# Altium schematic sheet L506.SchDoc
size A3
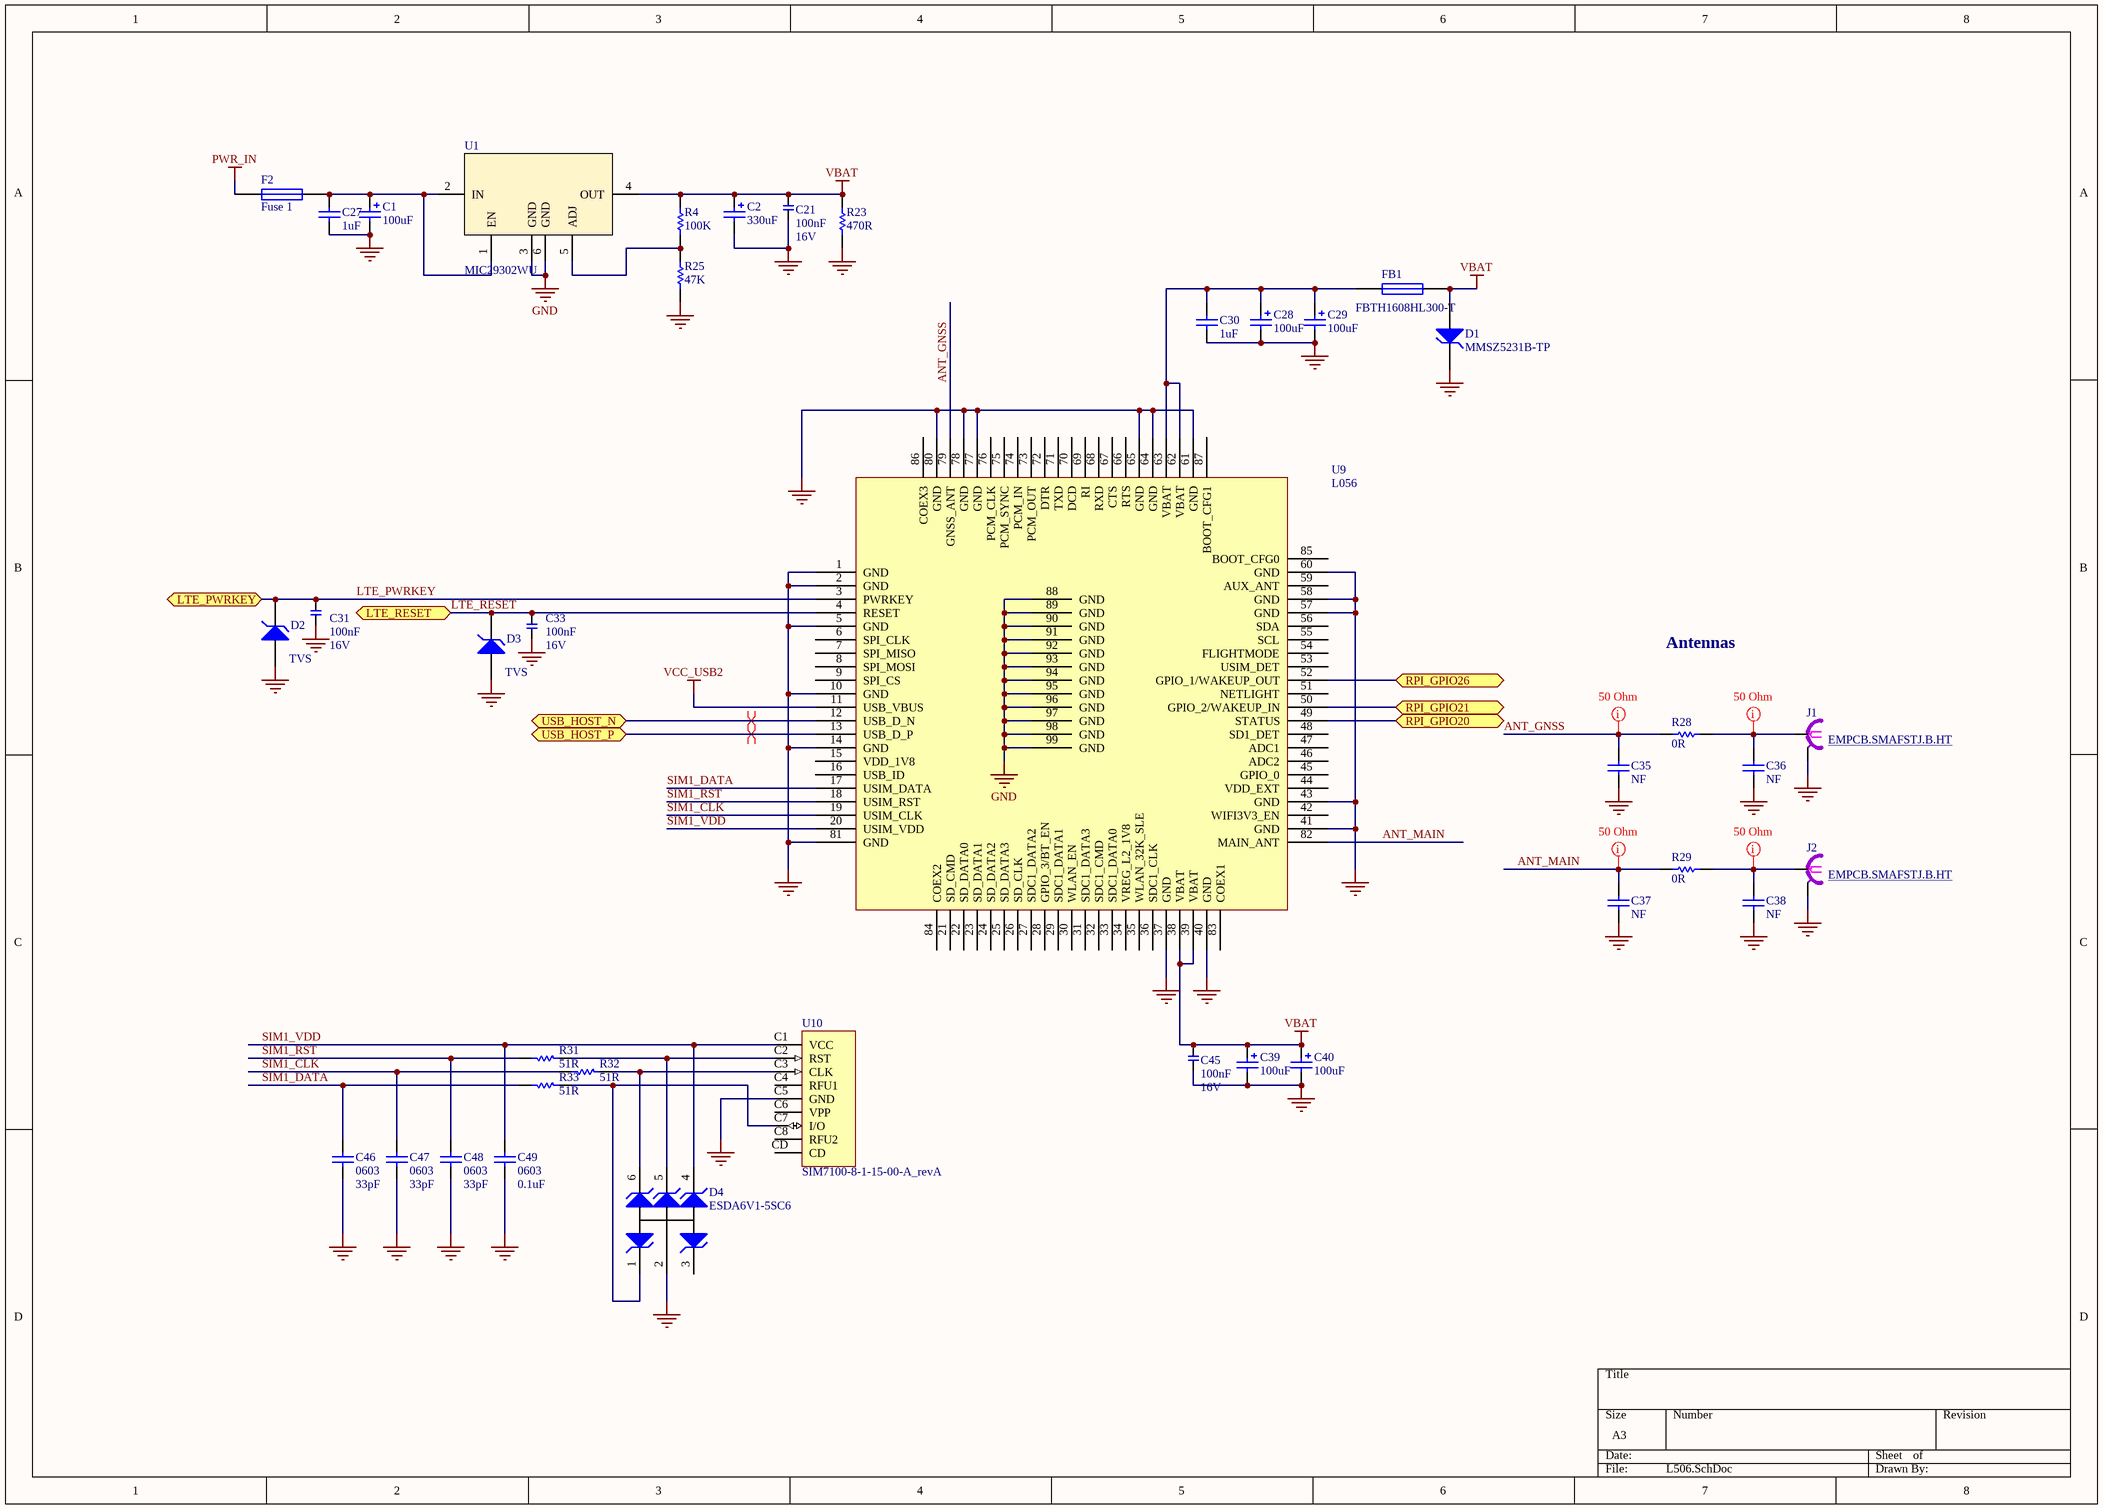
[diagram p0: L506.SchDoc]

## Parts
C1  100uF  [2312 Tant]
C2  330uF  [2312 Tant]
C21  Rating: 16V  [T_CAPC0603X33N]  (hidden comment: 100nF)
C27  1uF  [CAPC1608X100N]
C28  100uF  [2312 Tant]
C29  100uF  [2312 Tant]
C30  1uF  [CAPC1608X100N]
C31  Rating: 16V  [T_CAPC0603X33N]  (hidden comment: 100nF)
C33  Rating: 16V  [T_CAPC0603X33N]  (hidden comment: 100nF)
C35  NF  [CAPC1608X100N]
C36  NF  [CAPC1608X100N]
C37  NF  [CAPC1608X100N]
C38  NF  [CAPC1608X100N]
C39  100uF  [2312 Tant]
C40  100uF  [2312 Tant]
C45  Rating: 16V  [T_CAPC0603X33N]  (hidden comment: 100nF)
C46  0603  value 33pF  [CAPC1608X100N]
C47  0603  value 33pF  [CAPC1608X100N]
C48  0603  value 33pF  [CAPC1608X100N]
C49  0603  value 0.1uF  [CAPC1608X100N]
D1  MMSZ5231B-TP  [SOD3715X145N]
D2  TVS  [SOD3715X145N]
D3  TVS  [SOD3715X145N]
D4  ESDA6V1-5SC6  [SOT95P280X100-6N]
F2  Fuse 1  [SSQC_BEL]
FB1  FBTH1608HL300-T  [IND-0603]
J1  EMPCB.SMAFSTJ.B.HT  [EMPCB.SMAFSTJ.B.HT]
J2  EMPCB.SMAFSTJ.B.HT  [EMPCB.SMAFSTJ.B.HT]
R4  100K  [RESC1608X50N]
R23  470R  [RESC1608X50N]
R25  47K  [RESC1608X50N]
R28  0R  [RESC1608X50N]
R29  0R  [RESC1608X50N]
R31  51R  [RESC1608X50N]
R32  51R  [RESC1608X50N]
R33  51R  [RESC1608X50N]
U1  MIC29302WU  [MIC29302WU]
U9  L056  [L506]
U10  SIM7100-8-1-15-00-A_revA  [SIM7100-8-1-15-00-A_revA]

## Ports
LTE_PWRKEY (bidir), LTE_RESET (bidir), RPI_GPIO20 (bidir), RPI_GPIO21 (bidir), RPI_GPIO26 (bidir), USB_HOST_N (bidir), USB_HOST_P (bidir)

## Nets
GND: C1.2 C2.2 C21.1 C27.2 C28.2 C29.2 C30.2 C31.1 C33.1 C35.1 C36.1 C37.1 C38.1 C39.2 C40.2 C45.1 C46.2 C47.2 C48.2 C49.2 D1.2(K) D2.1(A) D3.1(A) D4.2(K) J1.2(GND) J2.2(GND) R23.2 R25.2 U1.3(GND) U1.6(GND) U9.1(GND) U9.2(GND) U9.5(GND) U9.10(GND) U9.14(GND) U9.37(GND) U9.40(GND) U9.41(GND) U9.43(GND) U9.57(GND) U9.58(GND) U9.60(GND) U9.61(GND) U9.64(GND) U9.65(GND) U9.77(GND) U9.78(GND) U9.80(GND) U9.81(GND) U9.88(GND) U9.89(GND) U9.90(GND) U9.91(GND) U9.92(GND) U9.93(GND) U9.94(GND) U9.95(GND) U9.96(GND) U9.97(GND) U9.98(GND) U9.99(GND) U10.C5(GND)
PWR_IN: F2.1
VBAT: C2.1 C21.2 C39.1 C40.1 C45.2 D1.1(A) FB1.2 R4.1 R23.1 U1.4(OUT) U9.38(VBAT) U9.39(VBAT)
VCC_USB2: U9.11(USB_VBUS)
ANT_GNSS: C35.2 R28.1 U9.79(GNSS_ANT)
ANT_MAIN: C37.2 R29.1 U9.82(MAIN_ANT)
LTE_PWRKEY: C31.2 D2.2(K) U9.3(PWRKEY) ; port LTE_PWRKEY
LTE_RESET: C33.2 D3.2(K) U9.4(RESET) ; port LTE_RESET
RPI_GPIO20: U9.49(STATUS) ; port RPI_GPIO20
RPI_GPIO21: U9.50(GPIO_2/WAKEUP_IN) ; port RPI_GPIO21
RPI_GPIO26: U9.52(GPIO_1/WAKEUP_OUT) ; port RPI_GPIO26
SIM1_CLK: C47.1 R32.1 U9.19(USIM_CLK)
SIM1_DATA: C46.1 R33.1 U9.17(USIM_DATA)
SIM1_RST: C48.1 R31.1 U9.18(USIM_RST)
SIM1_VDD: C49.1 D4.4(A) U9.20(USIM_VDD) U10.C1(VCC)
USB_HOST_N: U9.12(USB_D_N) ; port USB_HOST_N
USB_HOST_P: U9.13(USB_D_P) ; port USB_HOST_P
NetC1_1: C1.1 C27.1 F2.2 U1.1(EN) U1.2(IN)
NetC28_1: C28.1 C29.1 C30.1 FB1.1 U9.62(VBAT) U9.63(VBAT)
NetC36_2: C36.2 J1.1(Signal) R28.2
NetC38_2: C38.2 J2.1(Signal) R29.2
NetD4_1: D4.1(K) R33.2 U10.C7(I/O)
NetD4_5: D4.5(A) R31.2 U10.C2(RST)
NetD4_6: D4.6(A) R32.2 U10.C3(CLK)
NetR4_2: R4.2 R25.1 U1.5(ADJ)

Not connected (* = marked no-connect by the designer): D4 3(K); U9 6(SPI_CLK) 7(SPI_MISO) 8(SPI_MOSI) 9(SPI_CS) 15(VDD_1V8) 16(USB_ID) 21(SD_CMD) 22(SD_DATA0) 23(SD_DATA1) 24(SD_DATA2) 25(SD_DATA3) 26(SD_CLK) 27(SDC1_DATA2) 28(GPIO_3/BT_EN) 29(SDC1_DATA1) 30(WLAN_EN) 31(SDC1_DATA3) 32(SDC1_CMD) 33(SDC1_DATA0) 34(VREG_L2_1V8) 35(WLAN_32K_SLE) 36(SDC1_CLK) 42(WIFI3V3_EN) 44(VDD_EXT) 45(GPIO_0) 46(ADC2) 47(ADC1) 48(SD1_DET) 51(NETLIGHT) 53(USIM_DET) 54(FLIGHTMODE) 55(SCL) 56(SDA) 59(AUX_ANT) 66(RTS) 67(CTS) 68(RXD) 69(RI) 70(DCD) 71(TXD) 72(DTR) 73(PCM_OUT) 74(PCM_IN) 75(PCM_SYNC) 76(PCM_CLK) 83(COEX1) 84(COEX2) 85(BOOT_CFG0) 86(COEX3) 87(BOOT_CFG1); U10 C4(RFU1) C6(VPP) C8(RFU2) CD

## Layout directives
differential pair: USB_HOST_N, USB_HOST_P
net class 50 Ohm: ANT_GNSS, ANT_MAIN, NetC36_2, NetC38_2

## Notes on the sheet
- Antennas

## Library data of the parts
C1 C2 C28 C29 C39 C40 = Cap Pol2: Polarized Capacitor (Axial); Published: 8-Jun-2000; LatestRevisionDate: 17-Jul-2002; LatestRevisionNote: Re-released for DXP Platform.; PackageReference: POLAR0.8; Publisher: Altium Limited; PackageDescription: Polarized Capacitor; 2 Leads
  C1 C28 C29 C39 C40: Value: 100uF
  C2: Value: 330uF
C21 C31 C33 C45 = C-X7R-100nF-16V-10%-0603: Capacitor Ceramic X7R 100nF 16V 10% 0603; Tolerance: 10%; Type: X7R; Value: 100nF
C27 C30 = CAP: mpn: C0603C105K8PACTU; E14 pn: 9227776; Value: 1uF
C35 C37 = CMP-16466678-5: CAP CER 10NF 50V 5% X7R 0805; Manufacturer Part Number: 08055C103JAT2A; Capacitance: 1e-08 F; Insulation Resistance: 1e+11 Ω; Voltage Rating (DC): 50.0 V; Dielectric Material: Ceramic Multilayer; Lead-Free Status: Lead Free; Case/Package (SI): 2012; Octopart Url: https://octopart.com/08055c103jat2a-avx+interconnect+%2F+elco-39513106; Capacitance Tolerance: ±5%; OctopartID: 02fac9aacb8edd3d; Number of Pins: 2; Size-Height: 0.00094 m; Size-Width: 0.0012446 m; RoHS: Compliant; REACH SVHC Compliance: No SVHC; Size-Length: 0.0020066 m; Size-Thickness: 0.0009398 m; Case/Package: 0805; Dielectric Characteristic: X7R; Mounting Style: Surface Mount
C36 C38 = 08055C103JAT2A: CAP CER 10NF 50V 5% X7R 0805; Capacitance: 1e-08 F; Insulation Resistance: 1e+11 Ω; Voltage Rating (DC): 50.0 V; Dielectric Material: Ceramic Multilayer; Lead-Free Status: Lead Free; Case/Package (SI): 2012; Octopart Url: https://octopart.com/08055c103jat2a-avx+interconnect+%2F+elco-39513106; Capacitance Tolerance: ±5%; OctopartID: 02fac9aacb8edd3d; Number of Pins: 2; Size-Height: 0.00094 m; Size-Width: 0.0012446 m; RoHS: Compliant; REACH SVHC Compliance: No SVHC; Size-Length: 0.0020066 m; Size-Thickness: 0.0009398 m; Case/Package: 0805; Manufacturer Part Number: 08055C103JAT2A; Dielectric Characteristic: X7R; Mounting Style: Surface Mount
C46-C48 = CAP: CAP CER 33PF 50V C0G/NP0 0603; Manufacturer PN: C0603C330J5GACTU; MANUFACTURER: Kemet
C49 = CAP: CAP CER 0.1UF 16V X7R 0603; Manufacturer PN: C0603C104M4RACTU; MANUFACTURER: Kemet
D1 = D Zener: Zener Diode; MANUFACTURER: Micro Commercial Co; Manufacturer PN: MMSZ5231B-TP; LatestRevisionDate: 17-Jul-2002; LatestRevisionNote: Re-released for DXP Platform.; Publisher: Altium Limited; PackageDescription: Diode, Thru-Hole; 2 Leads; 0.7 in Pin Spacing
D2 D3 = D Zener: Zener Diode; Manufacturer PN: MMSZ5231B-TP; MANUFACTURER: Micro Commercial Co; LatestRevisionDate: 17-Jul-2002; LatestRevisionNote: Re-released for DXP Platform.; Publisher: Altium Limited; PackageDescription: Diode, Thru-Hole; 2 Leads; 0.7 in Pin Spacing
D4 = CMP-924f5b40f9684d88-1: ESDA Series 5 Channel 6.1 V 50 pF SMT Uni Directional Transil Array - SOT-23-6L; Operating Voltage: 6.10 V; Power Rating: 100 W; Breakdown Voltage: 7.20 V; Lead-Free Status: Lead Free; REACH SVHC Compliance: No SVHC; Number of Pins: 6; Case/Package: SOT-23; Size-Width: 1.75 mm; Mounting Style: Surface Mount; Manufacturer Part Number: ESDA6V1-5SC6; Size-Height: 1.45 mm; OctopartID: 924f5b40f9684d88; Size-Length: 3.05 mm; Packaging: Tape & Reel (TR), Cut Tape (CT); Octopart URL: http://octopart.com/esda6v1-5sc6-stmicroelectronics-347713; RoHS: Compliant; Voltage Rating (DC): 6.10 V; Lifecycle Status: Active
F2 = Fuse 1: Fuse; mpn: SSQC 3; Published: 8-Jun-2000; LatestRevisionDate: 17-Jul-2002; LatestRevisionNote: Re-released for DXP Platform.; PackageReference: PIN-W2/E2.8; PackageDescription: Thru-Hole; 2 Leads
FB1 = Fuse 1: Fuse; Manufacturer Part Number: 0ZRM0050FF1E
J1 J2 = U.FL-R-SMT-1(10): RECPT ULTRA-MINI COAX SMD
R4 R23 R25 = Res1: Resistor; Published: 8-Jun-2000; LatestRevisionDate: 17-Jul-2002; LatestRevisionNote: Re-released for DXP Platform.; PackageReference: AXIAL-0.3; Publisher: Altium Limited; PackageDescription: Axial Device, Thru-Hole; 2 Leads; 0.3 in Pin Spacing
  R4: Value: 100K
  R23: Value: 470R
  R25: Value: 47K
R28 R29 = CRCW08050000Z0EAHP: RES SMD 0.0 OHM JUMPER 1/3W 0805; Lead-Free Status: Lead Free; Power Rating: 0.125 W; Resistance: 0.0 Ω; Voltage Rating (DC): 150.0 V; Case/Package: 0805; Number of Pins: 2; Octopart Url: https://octopart.com/crcw08050000z0eahp-vishay-44321084; OctopartID: d14c1ae2bd160e8b; RoHS: Compliant
R31-R33 = Res1: RES SMD 1K OHM 1% 1/10W 0603; Manufacturer: Yageo; Manufacturer PN: RC0603FR-0751RL; Value: 51R; Supplier 1: Digikey
U10 = SIM7100-8-1-15-00-A_revA: Micro SIM Card Connector - Push-Push Type, 8 Pin, SMT, 1.50mm Profile